# Altium project OLA_LADOWARKA.PrjPcb
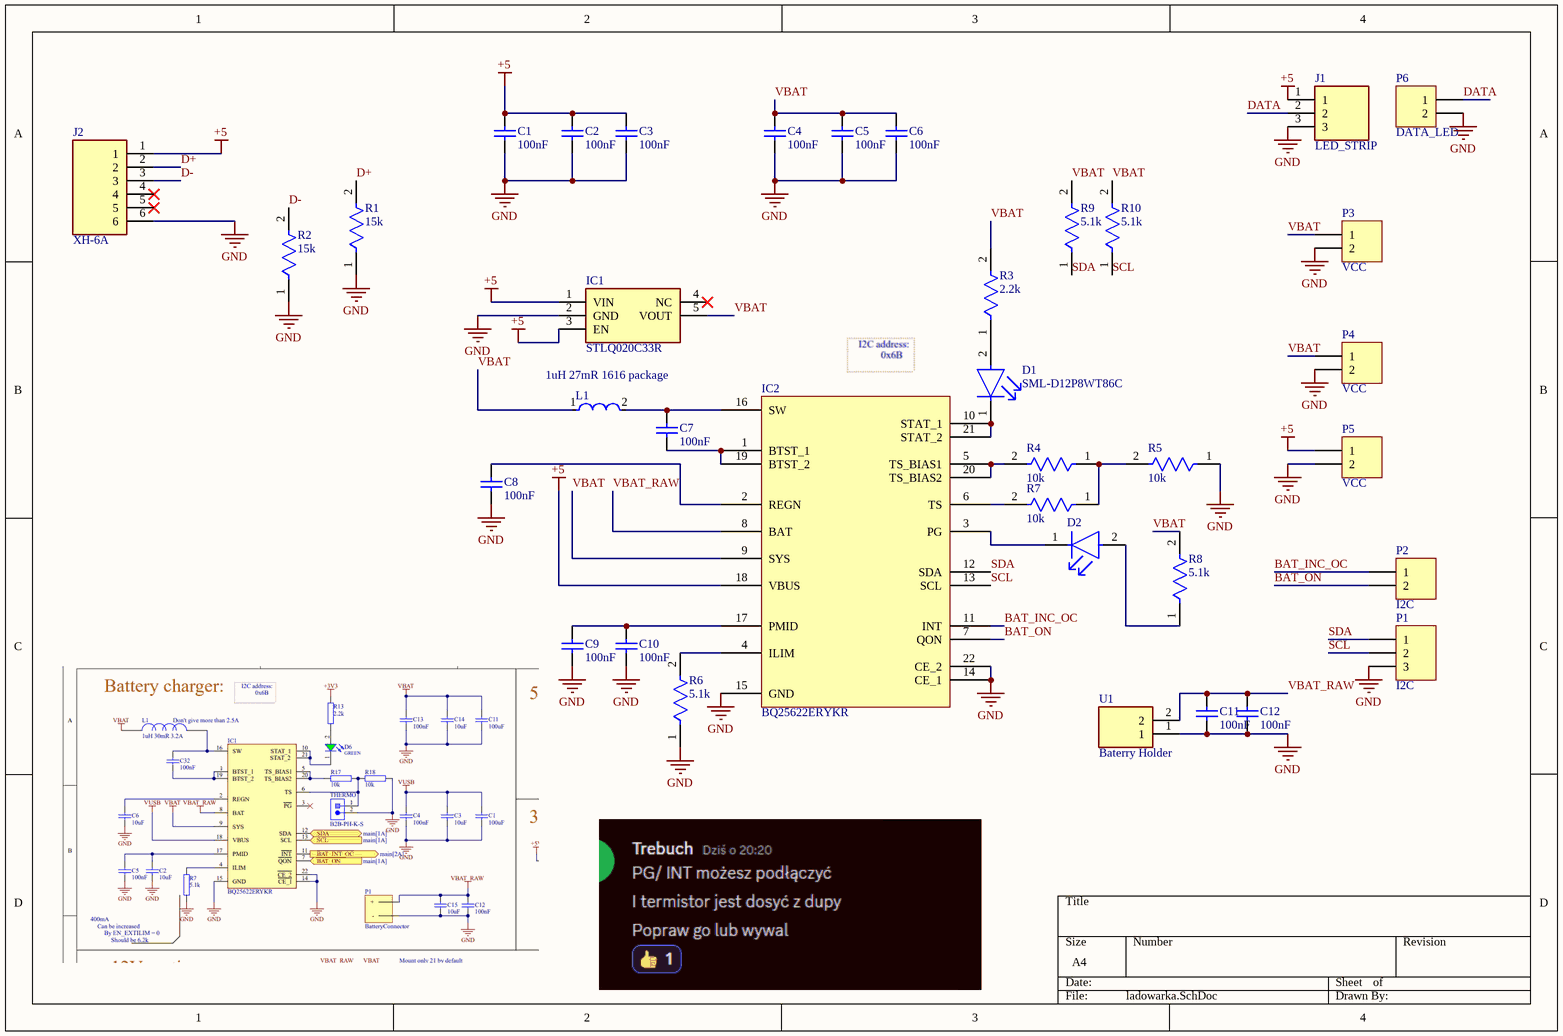
[diagram p0: ladowarka.SchDoc]
1 sheet, 36 parts. Net scope: global (net labels, ports and power ports of the same name join across sheets).
Board file: Ladowarka.PcbDoc

## Sheet ladowarka.SchDoc
size A4; SheetNumber: 1; SheetTotal: 1; SPICEModelCacheVYCWZEMJ: <root> / <DocumentId>VYCWZEMJ</DocumentId> / <CacheFrame Number="0"> / <Model Name="cap" Kind="MDL"> / <Text>*Default semiconductor capacitor / .MODEL CAP C()</Text> / </Model> / </CacheFrame> / </root>

### Parts
C1  100nF  [1608[0603]]
C2  100nF  [1608[0603]]
C3  100nF  [1608[0603]]
C4  100nF  [1608[0603]]
C5  100nF  [1608[0603]]
C6  100nF  [1608[0603]]
C7  100nF  [1608[0603]]
C8  100nF  [1608[0603]]
C9  100nF  [1608[0603]]
C10  100nF  [1608[0603]]
C11  100nF  [1608[0603]]
C12  100nF  [1608[0603]]
D1  SML-D12P8WT86C  [FP-SML-D12-MFG]
D2  SML-D12P8WT86C  [FP-SML-D12-MFG]  (value not drawn)
IC1  STLQ020C33R  [SOT65P210X110-5N]
IC2  BQ25622ERYKR  [BQ25620RYKR]
J1  LED_STRIP  [SHDR3W64P0X250_1X3_990X575X700P]
J2  XH-6A  [SHDR6W64P0X250_1X6_1750X580X720P]
L1  1uH 27mR 1616 package  [FP-IHLP-1616BZ-FP_1_8545x-MFG]
P1  I2C  [HDR1X3]
P2  I2C  [HDR1X2]
P3  VCC  [HDR1X2]
P4  VCC  [HDR1X2]
P5  VCC  [HDR1X2]
P6  DATA_LED  [HDR1X2]
R1  15k  [FP-CRCW0603-e3-MFG]
R2  15k  [FP-CRCW0603-e3-MFG]
R3  2.2k  [FP-CRCW0603-e3-MFG]
R4  10k  [FP-CRCW0603-e3-MFG]
R5  10k  [FP-CRCW0603-e3-MFG]
R6  5.1k  [FP-CRCW0603-e3-MFG]
R7  10k  [FP-CRCW0603-e3-MFG]
R8  5.1k  [FP-CRCW0603-e3-MFG]
R9  5.1k  [FP-CRCW0603-e3-MFG]
R10  5.1k  [FP-CRCW0603-e3-MFG]
U1  Baterry Holder  [1053]

### Nets
+5: C1.1 C2.1 C3.1 IC1.1(VIN) IC1.3(EN) IC2.18(VBUS) J1.1 J2.1 P5.1
GND: C1.2 C2.2 C3.2 C4.2 C5.2 C6.2 C8.2 C9.2 C10.2 C11.2 C12.2 IC1.2(GND) IC2.14(CE_1) IC2.15(GND) IC2.22(CE_2) J1.3 J2.6 P1.3 P3.2 P4.2 P5.2 P6.2 R1.1 R2.1 R5.1 R6.1 U1.1
BAT_INC_OC: IC2.11(INT) P2.1
BAT_ON: IC2.7(QON) P2.2
D+: J2.2 R1.2
D-: J2.3 R2.2
DATA: J1.2 P6.1
SCL: IC2.13(SCL) P1.2 R10.1
SDA: IC2.12(SDA) P1.1 R9.1
VBAT: C4.1 C5.1 C6.1 IC1.5(VOUT) IC2.9(SYS) L1.1 P3.1 P4.1 R3.2 R8.2 R9.2 R10.2
VBAT_RAW: C11.1 C12.1 IC2.8(BAT) U1.2
NetC7_1: C7.1 IC2.16(SW) L1.2
NetC7_2: C7.2 IC2.1(BTST_1) IC2.19(BTST_2)
NetC8_1: C8.1 IC2.2(REGN)
NetC9_1: C9.1 C10.1 IC2.17(PMID)
NetD1_1: D1.1(C) IC2.10(STAT_1) IC2.21(STAT_2)
NetD1_2: D1.2(A) R3.1
NetD2_1: D2.1(C) IC2.3(PG)
NetD2_2: D2.2(A) R8.1
NetIC2_4: IC2.4(ILIM) R6.2
NetIC2_5: IC2.5(TS_BIAS1) IC2.20(TS_BIAS2) R4.2
NetIC2_6: IC2.6(TS) R7.2
NetR4_1: R4.1 R5.2 R7.1

Not connected (* = marked no-connect by the designer): IC1 4(NC)*; J2 4* 5*

### Library data of the parts
C1-C12 = Cap Semi: Capacitor (Semiconductor SIM Model); Published: 8-Jun-2000; LatestRevisionDate: 29-May-2009; LatestRevisionNote: IPC-7351 Footprint Added.; PackageReference: C1206; Publisher: Altium Limited; PackageDescription: Chip Capacitor; Value: 100nF
D1 D2 = CMP-08952-000001-1: LED GREEN 1608 SMD; Manufacturer: Rohm; Forward Current: 20mA; Luminous Intensity: 6.3mcd; Wavelength: 560nm; Automotive Grade: Grade 3; Reverse Voltage: 5V; Forward Voltage: 2.2V; Power Dissipation: 54mW; Led Orientation: Top View; Temperature Range Low: -40°C; Automotive: Yes; Height: 0.65mm; Manufacturer Part Number: SML-D12P8WT86C; Device Class L3: unset; Octopart: https://octopart.com/sml-d12p8wt86c-rohm-77740213; Lead Free: Yes; Digikey Description: LED GREEN 1608 SMD; Temperature Range High: +85°C; ComponentLink2URL: https://www.rohm.com/datasheet/SML-D12P8W(C)/sml-d12x8(c)-e; ComponentLink2Description: Datasheet; RoHS: TRUE; Device Class L2: LEDs; Package: SML-D12; Category: Diode; Temperature: -40°C to +85°C; Mouser Description: LED Uni-Color Green Automotive 2-Pin Chip 0603(1608Metric) T/R; Colour: Green; Device Class L1: Optoelectronics
IC1 = STLQ020C33R: Integrated Circuit; Manufacturer_Name: STMicroelectronics; Datasheet Link: https://www.st.com/resource/en/datasheet/stlq020.pdf; Height: 1.1mm; Manufacturer_Part_Number: STLQ020C33R; Mouser Part Number: 511-STLQ020C33R; Mouser Price/Stock: https://www.mouser.co.uk/ProductDetail/STMicroelectronics/STLQ020C33R?qs=%252B6g0mu59x7LMe2XkJbXkFw%3D%3D; Arrow Part Number: STLQ020C33R; Arrow Price/Stock: https://www.arrow.com/en/products/stlq020c33r/stmicroelectronics?region=nac
IC2 = BQ25622ERYKR: Integrated Circuit; Manufacturer_Name: Texas Instruments; Datasheet Link: https://www.ti.com/lit/ds/symlink/bq25622e.pdf; Height: 0.8mm; Manufacturer_Part_Number: BQ25620RYKR; Mouser Part Number: 595-BQ25620RYKR; Mouser Price/Stock: https://www.mouser.co.uk/ProductDetail/Texas-Instruments/BQ25620RYKR?qs=T%252BzbugeAwji%252BU45Wuf4i%252Bw%3D%3D; Arrow Part Number: BQ25620RYKR; Arrow Price/Stock: https://www.arrow.com/en/products/bq25620rykr/texas-instruments?region=nac
J1 = B3B-XH-A: Connector; Manufacturer_Name: JST (JAPAN SOLDERLESS TERMINALS); Datasheet Link: http://www.jst-mfg.com/product/pdf/eng/eXH.pdf; Height: 7mm; Manufacturer_Part_Number: B3B-XH-A
J2 = XH-6A: Connector; Manufacturer_Name: BOOMELE(Boom Precision Elec); Datasheet Link: https://datasheet.lcsc.com/szlcsc/1810221832_BOOMELE-Boom-Precision-Elec-XH-6A_C5663.pdf; Height: 7.2mm; Manufacturer_Part_Number: XH-6A
L1 = CMP-02424-000223-1: Fixed Inductors Commercial Low DCR Series SMT 1uH 4.5A 27mΩ 20%; Core Material: Ferrite; Test Frequency: 100kHz; Shielding: Shielded; Self Resonant Frequency: 64MHz; Saturation Current: 5A; Inductance Tolerance: 20%; Min Operating Temperature: -55°C; Lead Free: Lead Free; Inductance: 1uH; DC Resistance (DCR): 27mR; Contact Plating: Tin; Package Quantity: 4000; Military Standard: Not; Depth: 4.31mm; Tolerance: 20%; RMS Current (Irms): 4.5A; Packaging: Tape and Reel; Number of Pins: 1616; Case/Package: 1616; Termination: SMD/SMT; Height: 2mm; Current Rating: 4.5A; Case Code (Metric): 4040; Max Operating Temperature: 125°C; Case Code (Imperial): 1616; Max DC Current: 4.5A; Width: 0.16inch; Mount: Surface Mount; Length: 4.7mm; Radiation Hardening: No; Height - Seated (Max): 0.079inch
P1 = Header 3: Header, 3-Pin; LatestRevisionDate: 17-Jul-2002; LatestRevisionNote: Re-released for DXP Platform.; Publisher: Altium Limited
P2-P6 = Header 2: Header, 2-Pin; LatestRevisionDate: 17-Jul-2002; LatestRevisionNote: Re-released for DXP Platform.; Publisher: Altium Limited
R1-R10 = CMP-2000-03525-2: RES Thick Film, 10kΩ, 1%, 0.1W, 100ppm/°C, 0603; Max Power Dissipation: 100mW; Working Voltage: 75V; Resistance: 66.5kR; Composition: Thick Film; Radiation Hardening: No; Length: 1.55mm; Package Quantity: 10; Min Operating Temperature: -55°C; Features: Automotive AEC-Q200; Number of Pins: 2; Weight: 7.1E-05oz; Case/Package: 0603; Case Code (Imperial): 0603; Military Standard: Not; Height: 0.45mm; Tolerance: 1%; Power Rating: 100mW; Voltage Rating: 75V; Case Code (Metric): 1608; Number of Terminations: 2; Width: 0.85mm; Packaging: Tape and Reel; Contact Plating: Tin; Termination: SMD/SMT; Max Operating Temperature: 155°C; Depth: 0.85mm; Temperature Coefficient: 100ppm/°C
U1 = 1053: Undefined or Miscellaneous; Manufacturer_Name: Keystone Electronics; Datasheet Link: http://www.keyelco.com/product-pdf.cfm?p=751; Manufacturer_Part_Number: 1053; Mouser Part Number: 534-1053-BH; Mouser Price/Stock: https://www.mouser.co.uk/ProductDetail/Keystone-Electronics/1053?qs=%2F7TOpeL5Mz4zfgvqwo9sng%3D%3D; Arrow Part Number: 1053; Arrow Price/Stock: https://www.arrow.com/en/products/1053/keystone-electronics